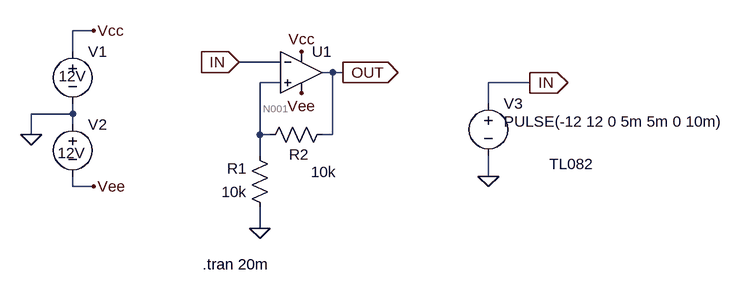
[diagram p0: schematic Schmitt-INV.asc]
* Schmitt-INV.asc
* U1: TL082 (symbol OpAmp.Add\TL082 not available, pins judged from their places): In+=N001 In-=IN V+=Vcc V-=Vee OUT=OUT
V1 Vcc 0 12V
V2 0 Vee 12V
V3 IN 0 PULSE(-12 12 0 5m 5m 0 10m) AC 1
R1 0 N001 10k
R2 OUT N001 10k
.tran 20m
.backanno
.end

* Results of the author's LTspice run, read from the files saved beside the schematic
* Operating Point, zero values left out:
*   V(in) = -12 V
*   V(n001) = 5.262 V
*   V(vcc) = 12 V
*   V(vee) = -12 V
*   V(out) = 10.52 V
*   I(R2) = 526.2 µA
*   I(R1) = -526.2 µA
*   I(V3) = 90.12 µA
*   I(V2) = -1.95 mA
*   I(V1) = -2.566 mA
*   Ix(u1:1) = 117.8 pA
*   Ix(u1:2) = -90.12 µA
*   Ix(u1:99) = 2.566 mA
*   Ix(u1:50) = -1.95 mA
*   Ix(u1:28) = -526.2 µA
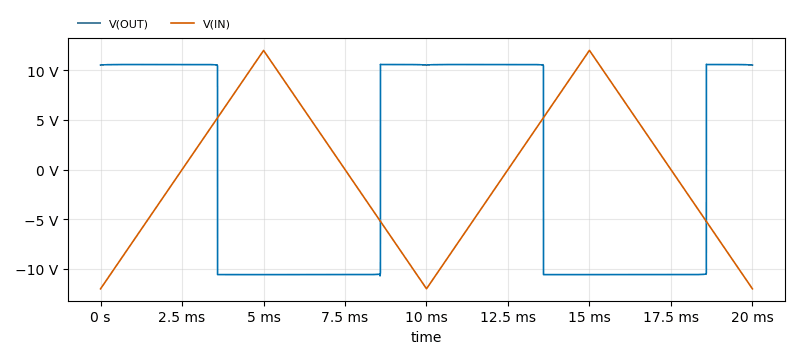
[diagram p1: Transient Analysis of Schmitt-INV.asc, plotted from the saved traces]
* Transient Analysis, 1 run:
*   V(OUT): min -10.7 V, max 10.59 V, average 2.741 mV, rms 10.57 V, last 10.52 V
*   V(IN): min -12 V, max 12 V, average -290 µV, rms 8.077 V, last -12 V